# Altium schematic sheet IFC6601.SchDoc
size A
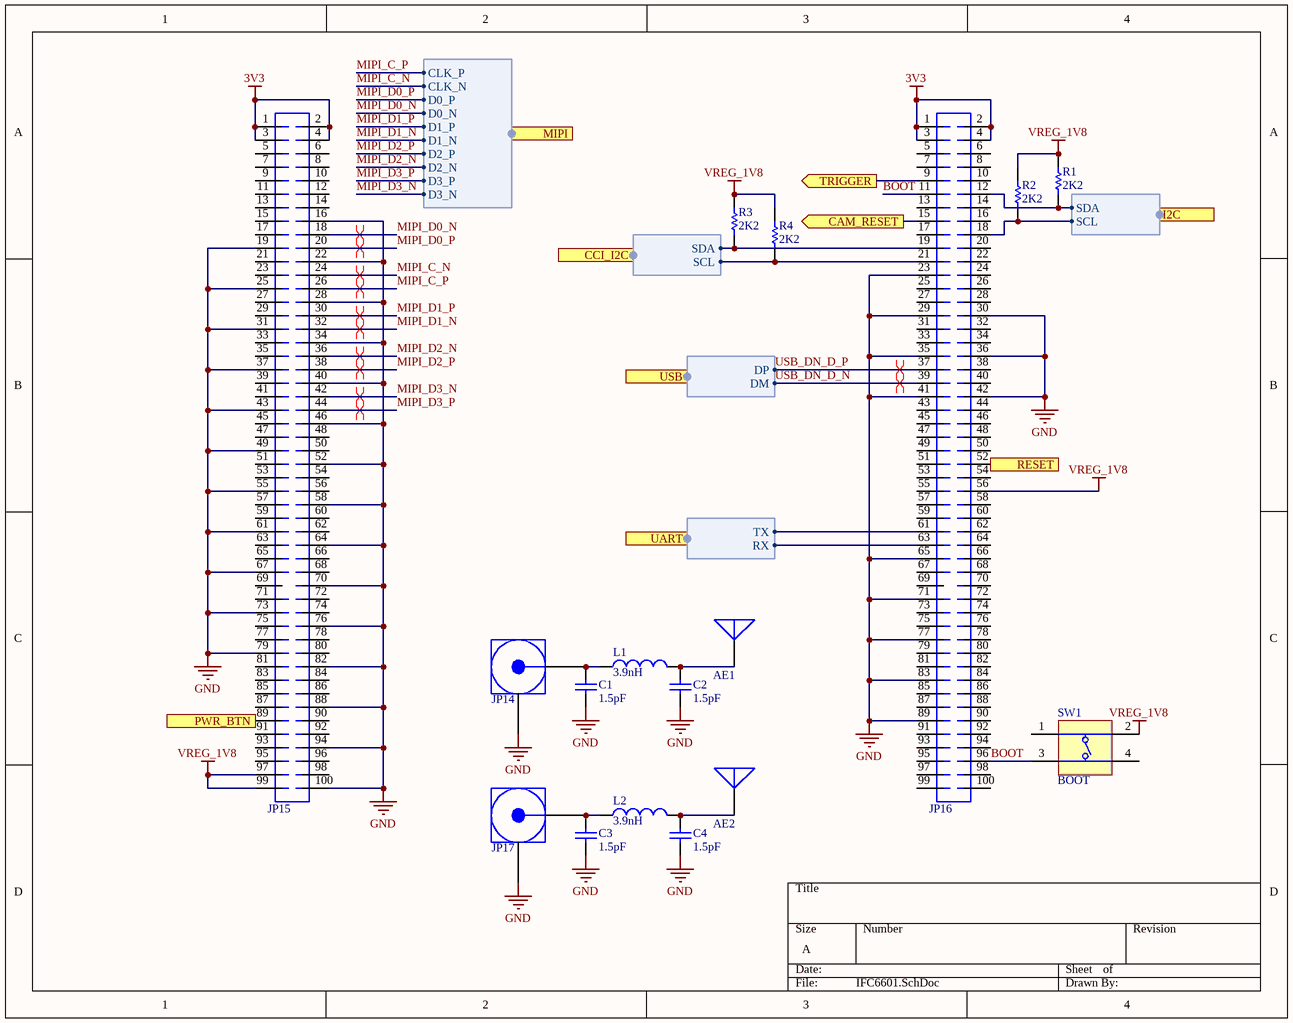
[diagram p0: IFC6601.SchDoc]

## Parts
AE1  2450AT42A100E  [ANTENNA (3.2x1.6MM)]  (value not drawn)
AE2  2450AT42A100E  [ANTENNA (3.2x1.6MM)]  (value not drawn)
C1  value 1.5pF  [C0402[1005X55]]  (hidden comment: 1.5pF 50V 0402)
C2  value 1.5pF  [C0402[1005X55]]  (hidden comment: 1.5pF 50V 0402)
C3  value 1.5pF  [C0402[1005X55]]  (hidden comment: 1.5pF 50V 0402)
C4  value 1.5pF  [C0402[1005X55]]  (hidden comment: 1.5pF 50V 0402)
JP14  MM4829-2702RB0  [COAX-HSC]  (value not drawn)
JP15  SAMTEC_SS4_100_RECEPTACLE  [SAMTEC-SS4-100-RECEPTACLE]  (value not drawn)
JP16  SAMTEC_SS4_100_RECEPTACLE  [SAMTEC-SS4-100-RECEPTACLE]  (value not drawn)
JP17  MM4829-2702RB0  [COAX-HSC]  (value not drawn)
L1  3.9nH  [IND0402]
L2  3.9nH  [IND0402]
R1  value 2K2  [R0402[1005]]  (hidden comment: 2K2 1% 0402)
R2  value 2K2  [R0402[1005]]  (hidden comment: 2K2 1% 0402)
R3  value 2K2  [R0402[1005]]  (hidden comment: 2K2 1% 0402)
R4  value 2K2  [R0402[1005]]  (hidden comment: 2K2 1% 0402)
SW1  BOOT  [SWITCH2]

## Ports
CAM_RESET (out), CCI_I2C (harness I2C), I2C (harness I2C), MIPI (harness MIPI), PWR_BTN (in), RESET (out), TRIGGER (out), UART (harness UART), USB (harness USB)

## Harnesses
UART: TX, RX
USB: DM, DP
I2C: SCL, SDA
MIPI: CLK_P, CLK_N, D0_P, D0_N, D1_P, D1_N, D2_P, D3_N, D2_N, D3_P

## Nets
3V3: JP15.1 JP15.2 JP15.3 JP15.4 JP16.1 JP16.2 JP16.3 JP16.4
GND: C1.1 C2.1 C3.1 C4.1 JP14.2 JP15.16 JP15.19 JP15.22 JP15.25 JP15.28 JP15.31 JP15.34 JP15.37 JP15.40 JP15.43 JP15.46 JP15.49 JP15.52 JP15.55 JP15.58 JP15.61 JP15.64 JP15.67 JP15.70 JP15.73 JP15.76 JP15.79 JP15.82 JP15.88 JP15.94 JP15.100 JP16.23 JP16.29 JP16.30 JP16.35 JP16.36 JP16.41 JP16.42 JP16.65 JP16.71 JP16.77 JP16.83 JP16.89 JP17.2
VREG_1V8: JP15.97 JP15.99 JP16.56 R1.2 R2.2 R3.2 R4.2 SW1.2(T2)
BOOT: JP16.11 JP16.96 SW1.3(T3)
CAM_RESET: JP16.15 ; port CAM_RESET
MIPI_C_N: JP15.24 ; port MIPI.CLK_N
MIPI_C_P: JP15.26 ; port MIPI.CLK_P
MIPI_D0_N: JP15.18 ; port MIPI.D0_N
MIPI_D0_P: JP15.20 ; port MIPI.D0_P
MIPI_D1_N: JP15.32 ; port MIPI.D1_N
MIPI_D1_P: JP15.30 ; port MIPI.D1_P
MIPI_D2_N: JP15.36 ; port MIPI.D2_N
MIPI_D2_P: JP15.38 ; port MIPI.D2_P
MIPI_D3_N: JP15.42 ; port MIPI.D3_N
MIPI_D3_P: JP15.44 ; port MIPI.D3_P
PWR_BTN: JP15.89 ; port PWR_BTN
RESET: JP16.52 ; port RESET
TRIGGER: JP16.9 ; port TRIGGER
USB_DN_D_N: JP16.39 ; port USB.DM
USB_DN_D_P: JP16.37 ; port USB.DP
NetAE1_1: AE1.1 C2.2 L1.2
NetAE2_1: AE2.1 C4.2 L2.2
NetC1_2: C1.2 JP14.1 L1.1
NetC3_2: C3.2 JP17.1 L2.1
NetJP16_12: JP16.12 R1.1 ; port I2C.SDA
NetJP16_18: JP16.18 R2.1 ; port I2C.SCL
NetJP16_19: JP16.19 R3.1 ; port CCI_I2C.SDA
NetJP16_21: JP16.21 R4.1 ; port CCI_I2C.SCL
NetJP16_61: JP16.61 ; port UART.TX
NetJP16_63: JP16.63 ; port UART.RX

Not connected (* = marked no-connect by the designer): JP15 5(3) 6(4) 7(4) 8(5) 9(5) 10(6) 11(6) 12(7) 13(7) 14(8) 15(8) 17(9) 21(11) 23(12) 27(14) 29(15) 33(17) 35(18) 39(20) 41(21) 45(23) 47(24) 48(25) 50(26) 51(26) 53(27) 54(28) 56(29) 57(29) 59(30) 60(31) 62(32) 63(32) 65(33) 66(34) 68(35) 69(35) 71(36) 72(37) 74(38) 75(38) 77(39) 78(40) 80(41) 81(41) 83(42) 84(43) 85(43) 86(44) 87(44) 90(46) 91(46) 92(47) 93(47) 95(48) 96(49) 98(50); JP16 5(3) 6(4) 7(4) 8(5) 10(6) 13(7) 14(8) 16(9) 17(9) 20(11) 22(12) 24(13) 25(13) 26(14) 27(14) 28(15) 31(16) 32(17) 33(17) 34(18) 38(20) 40(21) 43(22) 44(23) 45(23) 46(24) 47(24) 48(25) 49(25) 50(26) 51(26) 53(27) 54(28) 55(28) 57(29) 58(30) 59(30) 60(31) 62(32) 64(33) 66(34) 67(34) 68(35) 69(35) 70(36) 72(37) 73(37) 74(38) 75(38) 76(39) 78(40) 79(40) 80(41) 81(41) 82(42) 84(43) 85(43) 86(44) 87(44) 88(45) 90(46) 91(46) 92(47) 93(47) 94(48) 95(48) 97(49) 98(50) 99(50) 100(51); SW1 1(T1) 4(T3)

## Layout directives
differential pair: MIPI_C_N, MIPI_C_P, MIPI_D0_N, MIPI_D0_P, MIPI_D1_N, MIPI_D1_P, MIPI_D2_N, MIPI_D2_P, MIPI_D3_N, MIPI_D3_P, USB_DN_D_N, USB_DN_D_P

## Library data of the parts
AE1 AE2 = 2450AT42A100E: Manufacturer: Johanson Technology Inc.; PartNumber: 2450AT42A100E; Mounting Technology: Surface Mount
C1-C4 = CAP_1.5pF_50V_0402_0.05pF: 1.5pF 50V 0.05pF 0402 (1005 Metric); PartNumber: GRM1555C1H1R5WA01D; Manufacturer: Murata; Mounting Technology: Surface Mount; PackageReference: 0402; PackageDescription: 0402 (1005 Metric); Voltage: 50V; Tolerance: 0.05pF
JP14 JP17 = MM4829-2702RB0: CONN HSC RCPT STR 50 OHM SMD; Manufacturer: Murata; PackageReference: HSC; PartNumber: MM4829-2702RB0; Mounting Technology: Surface Mount
JP15 JP16 = SAMTEC_SS4_100_RECEPTACLE: Manufacturer: Samtec; PartNumber: SS4-50-3.00-L-D-K-TR; PackageReference: SS4-100; Mounting Technology: Surface Mount
L1 L2 = IND_3.9nH_0.3A_0402_0.3nH: 3.9nH +/-0.3nH 0.3A 0402; PartNumber: LQG15HS3N9S02D; Manufacturer: Murata; PackageReference: 0402; PackageDescription: 0402 (2012 metric); Mounting Technology: Surface Mount; Current: 0.3A; Value: 3.9nH
R1-R4 = RES_2K2_0402_1%: 2K2 0.063W 1% 0402 (1005 Metric); Manufacturer: KOA Speer; PartNumber: RK73H1ETTP2201F; Tolerance: 1%; Power: 0.063W; Mounting Technology: Surface Mount; PackageReference: 0402; PackageDescription: 0402 (1005 Metric); ComponentLink1Description: Datasheet; ComponentLink1URL: http://www.koaspeer.com/catimages/Products/RK73H/RK73H.pdf
SW1 = DIPT-DTSM-6: Switch, SPNO Push Button SMD; Manufacturer: C&K Components; PartNumber: PTS810 SJM 250 SMTR LFS; Packing Type: Tape&Reel; Mechanical Life: 200,000 cycles; ComponentLink2URL: http://www.dip.com.tw/Products_tact.htm; ComponentLink1URL: http://www.dip.com.tw/; ComponentLink3URL: http://www.dip.com.tw/PDF/pro_tact/DTSM_G_-6_2_-V.pdf; PackageDescription: Switch, Surface Mount, 4 Leads, Body 4.6x2.8mm, Height 1.9mm; ComponentLink2Description: Datasheet; ComponentLink3Description: Package Specification; ComponentLink1Description: Manufacturer URL; PackageReference: PTS810; Mounting Technology: Surface Mount